# EAGLE design blink1mk3_004 (EAGLE 9.0.1)
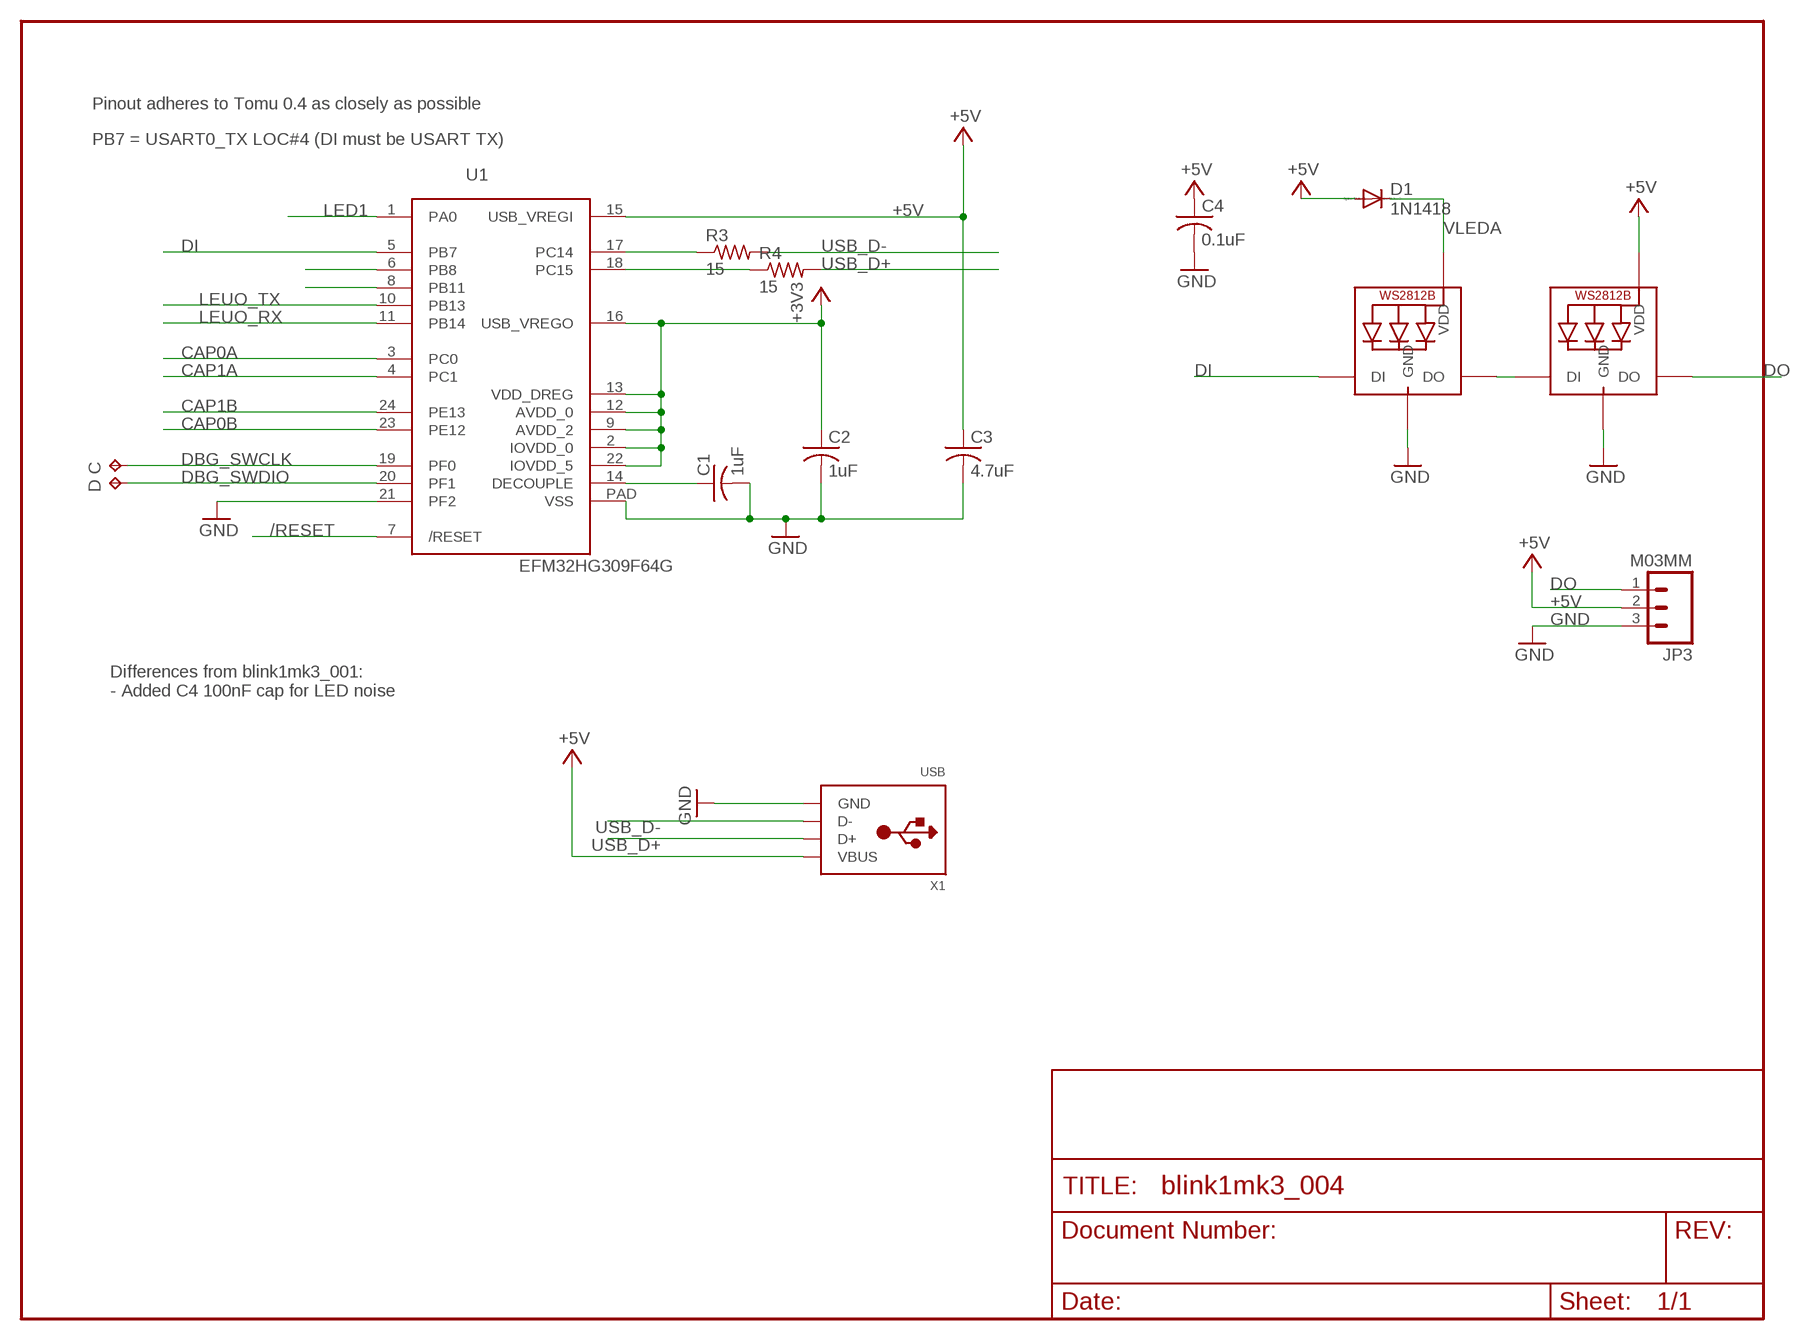
[diagram p0: schematic, sheet 1]

## Parts
C  TPTP10R  [TP10R]
C1  1uF  C-USC0402  [C0402]
C2  1uF  C-USC0402  [C0402]
C3  4.7uF  C-USC0402  [C0402]
C4  0.1uF  C-USC0402  [C0402]
D  TPTP10R  [TP10R]
D1  1N1418  DIODE-SOD523  [SOD523]
JP3  M03MM  [1X03-1.5MM]
LED1  WS2812B3535  [LED3535]
LED2  WS2812B3535  [LED3535]
R3  15  R-US_R0402  [R0402]
R4  15  R-US_R0402  [R0402]
U1  EFM32HG309F64G  [QFN24PAD]
X1  USB  [MOLEX-48037-1000]

## Nets
+3V3: C2.1 U1.2(IOVDD_0) U1.9(AVDD_2) U1.12(AVDD_0) U1.13(VDD_DREG) U1.16(USB_VREGO) U1.22(IOVDD_5)
+5V: C3.1 C4.1 D1.A JP3.2 LED2.2(VDD) U1.15(USB_VREGI) X1.1(VBUS)
/RESET: U1.7(/RESET)
CAP0A: U1.3(PC0)
CAP0B: U1.23(PE12)
CAP1A: U1.4(PC1)
CAP1B: U1.24(PE13)
DBG_SWCLK: C.TP U1.19(PF0)
DBG_SWDIO: D.TP U1.20(PF1)
DECOUPLE: C1.1 U1.14(DECOUPLE)
DI: LED1.1(DI) U1.5(PB7)
DO: JP3.1 LED2.3(DO)
GND: C1.2 C2.2 C3.2 C4.2 JP3.3 LED1.4(GND) LED2.4(GND) U1.21(PF2) U1.PAD(VSS) X1.4(GND)
LED1: U1.1(PA0)
LEUO_RX: U1.11(PB14)
LEUO_TX: U1.10(PB13)
N$1: U1.8(PB11)
N$2: LED1.3(DO) LED2.1(DI)
N$3: U1.6(PB8)
RUSB_D+: R4.1 U1.18(PC15)
RUSB_D-: R3.1 U1.17(PC14)
USB_D+: R4.2 X1.3(D+)
USB_D-: R3.2 X1.2(D-)
VLEDA: D1.C LED1.2(VDD)

## Notes on the sheet
- Pinout adheres to Tomu 0.4 as closely as possible
- PB7 = USART0_TX LOC#4 (DI must be USART TX)
- Differences from blink1mk3_001:
  - Added C4 100nF cap for LED noise

## Library data of the parts
C D = testpad:TP: Test pad
C1-C4 = adafruit:C-US: CAPACITOR, American symbol
D1 = diode:DIODE-: DIODE
JP3 = todstuff:M03
LED1 LED2 = adafruit:WS2812B
R3 R4 = adafruit:R-US_: RESISTOR, American symbol
U1 = todstuff:EFM32HG309F64G
X1 = todstuff:USB

## Board
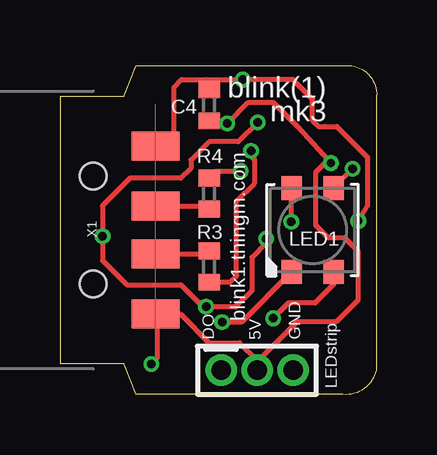
[diagram p1: board, top side]
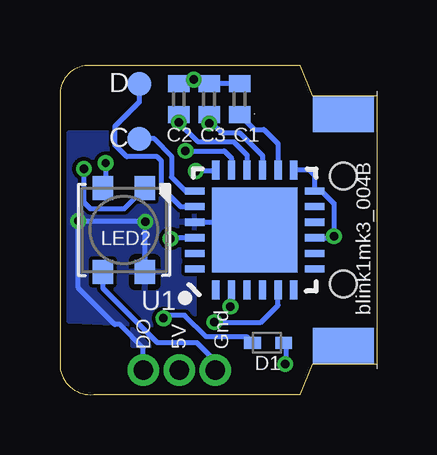
[diagram p2: board, bottom side, seen from below]

Size 13.21 x 13.72 mm. Coordinates in mm from the lower left corner, seen from the top.
Outline: 0,12.45 2.67,12.45 3.17,13.72 12.06,13.72 arc-90 13.21,12.45 13.21,1.15 arc-90 11.81,0.01 3.17,0.01 2.67,1.28 0,1.28 0,12.45
Copper layers (1*16): Top 0.035mm / dielectric 1.5mm / Bottom 0.035mm
Design rules "SeeedStudio_2layer_DRU_no_angle_20140221": minimum track width 6mil, minimum drill 12mil, track to track 6mil, track to pad 6mil, pad to pad 6mil, via to via 6mil, smd to smd 0mil, copper to edge 10mil, drill to drill 10mil, minimum pad ring 10mil, minimum via ring 6mil, stop-mask expansion 2mil, vias tented up to drill 100mil, thermal gap 10mil

### Footprints (pad centres in the part's own frame; a part is rotated, then mirrored left to right if it is on the bottom)
TP10R = smd 1 x 1: TP 0,0
C0402 = smd 0.7 x 0.9: 1 -0.65,0; 2 0.65,0
SOD523 = smd 0.7 x 0.5: A 0.7,0; C -0.6,0
1X03-1.5MM = drill 0.8 pad 1.27: 1 0,0; 2 1.5,0; 3 3,0
LED3535 = smd 1 x 0.85: 1 -1.75,0.875; 2 -1.75,-0.875; 3 1.75,-0.875; 4 1.75,0.875
R0402 = smd 0.7 x 0.9: 1 -0.65,0; 2 0.65,0
QFN24PAD = smd 0.8 x 0.3: 1 -2.5,1.625; 2 -2.5,0.975; 3 -2.5,0.325; 4 -2.5,-0.325; 5 -2.5,-0.975; 6 -2.5,-1.625; 13 2.5,-1.625; 14 2.5,-0.975; 15 2.5,-0.325; 16 2.5,0.325; 17 2.5,0.975; 18 2.5,1.625 | smd 0.3 x 0.8: 7 -1.625,-2.5; 8 -0.975,-2.5; 9 -0.325,-2.5; 10 0.325,-2.5; 11 0.975,-2.5; 12 1.625,-2.5; 19 1.625,2.5; 20 0.975,2.5; 21 0.325,2.5; 22 -0.325,2.5; 23 -0.975,2.5; 24 -1.625,2.5 | smd 3.55 x 3.55: PAD 0,0
MOLEX-48037-1000 = smd 2 x 1.2: 1 2.6,-3.5; 2 2.6,-1; 3 2.6,1; 4 2.6,3.5 | smd 2.54 x 1.524 bottom: P$1 0,4.85; P$2 0,-4.85 | hole 1.1: 0,2.25; 0,-2.25

### Placement (x,y rotation side)
C  9.91,10.67 0 bottom
C1  5.71,12.33 90 bottom
C2  8.25,12.33 90 bottom
C3  6.99,12.33 90 bottom
C4  6.22,12.07 90 top
D  9.91,12.96 0 bottom
D1  4.57,2.17 0 bottom
JP3  6.73,1.02 0 top
LED1  10.54,6.86 90 top
LED2  10.54,6.86 270 bottom
R3  6.22,5.34 90 top
R4  6.22,8.39 270 top
U1  5.08,6.86 90 bottom
X1  1.39,6.86 0 top

### Tracks (layer width: path | path; a pad name or v marks a point on that pad's centre or on a via)
+3V3  (via drill 0.35)
  Top 0.203: v8.6,6.51 8.6,6.32 8,5.72 8,4.32 7.33,3.66 v6.1,3.66 5.96,3.66 5.05,4.58 2.79,4.58 1.78,5.59 v1.78,6.61 1.78,7.88 2.92,9.02 5.05,9.02 5.46,9.44 5.46,9.79 6.22,10.55 7.45,10.55 v8.25,11.36
  Bottom 0.203: 5.46,9.45 U1.16 5.41,9.98 5.97,10.55 7.45,10.55 v8.25,11.36 | C2.1 v8.25,11.36 | v8.25,11.36 | U1.2 6.06,3.71 v6.1,3.66 | U1.22 8.56,6.54 v8.6,6.51 | U1.13 2.8,9.36 2.58,9.15 U1.12 2.3,8.49 1.78,7.97 v1.78,6.61 1.85,6.54 U1.9
+5V  (via drill 0.35)
  Top 0.203: 4.05,3.3 X1.1 5.02,3.36 6.22,2.17 7.49,2.17 8.25,1.4 | 4.05,3.3 4.43,2.93 | 8.25,1.4 8.23,1.38 JP3.2 | 11.25,9.72 9.91,11.18 8.89,12.2 7.87,12.2 v6.99,11.31 6.33,11.31 C4.1 | 11.25,9.72 v11.3,9.66 | v3.81,1.28 4.05,1.52 4.05,3.3 | 11.25,9.72 11.11,9.72 10.67,9.28 10.67,7.06 11.19,6.54 11.88,6.54 12.45,5.98 12.45,3.94 11.56,3.05 9.91,3.05 8.25,1.4
  Bottom 0.203: v6.99,11.31 6.94,11.34 C3.1 v6.99,11.31 | v3.81,1.28 3.77,1.31 3.77,2.07 D1.A | v6.99,11.31 6.86,11.31 6.48,10.93 5.71,10.93 4.75,9.97 U1.15 | v11.3,9.66 11.3,8.73 LED2.2
DBG_SWCLK
  Bottom 0.203: 10.16,10.67 C.TP 9.27,10.67 8.55,9.96 8.55,9.07 7.98,8.49 U1.19
DBG_SWDIO
  Bottom 0.203: D.TP 9.91,12.2 10.92,11.18 10.92,10.42 10.42,9.92 9.15,9.92 8.99,9.76 8.99,8.65 8.17,7.84 U1.20
DECOUPLE
  Bottom 0.152: 5.71,11.44 C1.1
  Bottom 0.203: C1.1 5.09,11.06 4.7,11.06 4.11,10.46 U1.14
DI  (via drill 0.35)
  Top 0.203: v6.76,3.02 7.57,3.02 LED1.1
  Bottom 0.203: v6.76,3.02 4.81,3.02 4.11,3.73 U1.5
DO
  Bottom 0.203: JP3.1 6.73,1.4 7.49,2.17 9.14,2.17 11.42,4.44 LED2.3 11.42,4.69
GND  (via drill 0.35)
  Top 0.203: 6.1,13.14 5.08,13.14 4.75,12.81 4.75,10.47 4.64,10.36 X1.4 | 6.1,13.14 v7.62,13.14 9.72,13.14 10.54,12.33 10.54,11.44 10.79,11.18 11.05,11.18 | 11.05,11.18 11.56,11.18 12.83,9.91 12.83,7.88 v12.45,7.25 | 11.06,11.17 11.05,11.18 | C4.2 6.1,12.85 6.1,13.14 | v9.65,7.21 9.65,8.6 LED1.4
  Bottom 0.203: JP3.3 9.73,1.95 10.7,2.93 10.92,2.93 12.45,4.45 v12.45,7.25 12.48,7.21 v9.65,7.21 9.67,7.2 LED2.4 | 5.33,6.86 U1.PAD | 5.43,7.21 U1.PAD | v7.62,13.14 8.42,13.14 C2.2 C3.2 C1.2 | U1.21 5.41,7.19 U1.PAD
  pour Bottom: 7.62,10.93 7.62,2.04 10.03,2.04 10.16,2.04 10.16,2.93 12.7,3.05 12.83,3.05 12.83,10.93 10.41,10.93 10.41,12.2 7.62,12.2 7.62,12.07
N$2  (via drill 0.35)
  Top 0.203: v12.21,9.42 11.42,8.63 LED1.3
  Bottom 0.203: 12.1,9.31 v12.21,9.42 12.21,8.03 11.94,7.75 10.54,7.75 10.53,7.75 LED2.1
RUSB_D+  (via drill 0.35)
  Top 0.203: R4.1 6.51,9.32 v7.55,9.32
  Bottom 0.203: U1.18 6.75,9.32 v7.55,9.32
RUSB_D-  (via drill 0.35)
  Top 0.203: R3.1 7.1,4.69 7.37,4.96 7.37,8.06 8.13,8.83 8.13,9.79 7.97,9.94 v7.97,10.17
  Bottom 0.203: v7.97,10.17 6.35,10.17 6.06,9.87 U1.17
USB_D+
  Top 0.203: X1.3 6.48,7.86 R4.2
USB_D-
  Top 0.203: X1.2 6.48,5.86 R3.2
VLEDA  (via drill 0.35)
  Top 0.203: LED1.2 11.42,4.59 10.64,3.82 9.53,3.82 v8.89,3.18
  Bottom 0.203: v8.89,3.18 8.76,3.31 8,3.31 7.11,2.42 5.43,2.42 D1.C

### Text on the board
tPlace: blink(1) | mk3 | blink1.thingm.com | DO | 5V | GND | LEDstrip
bPlace: blink1mk3_004B | Gnd | 5V | DO